# EasyEDA schematic mic_jammer_schematic_easyeda.json
TITLE: Sheet_2; REV: 1.0; Date: 2025-10-20; Sheet: 1/1; Drawn By: ardyprmbn7; Company: Your Company
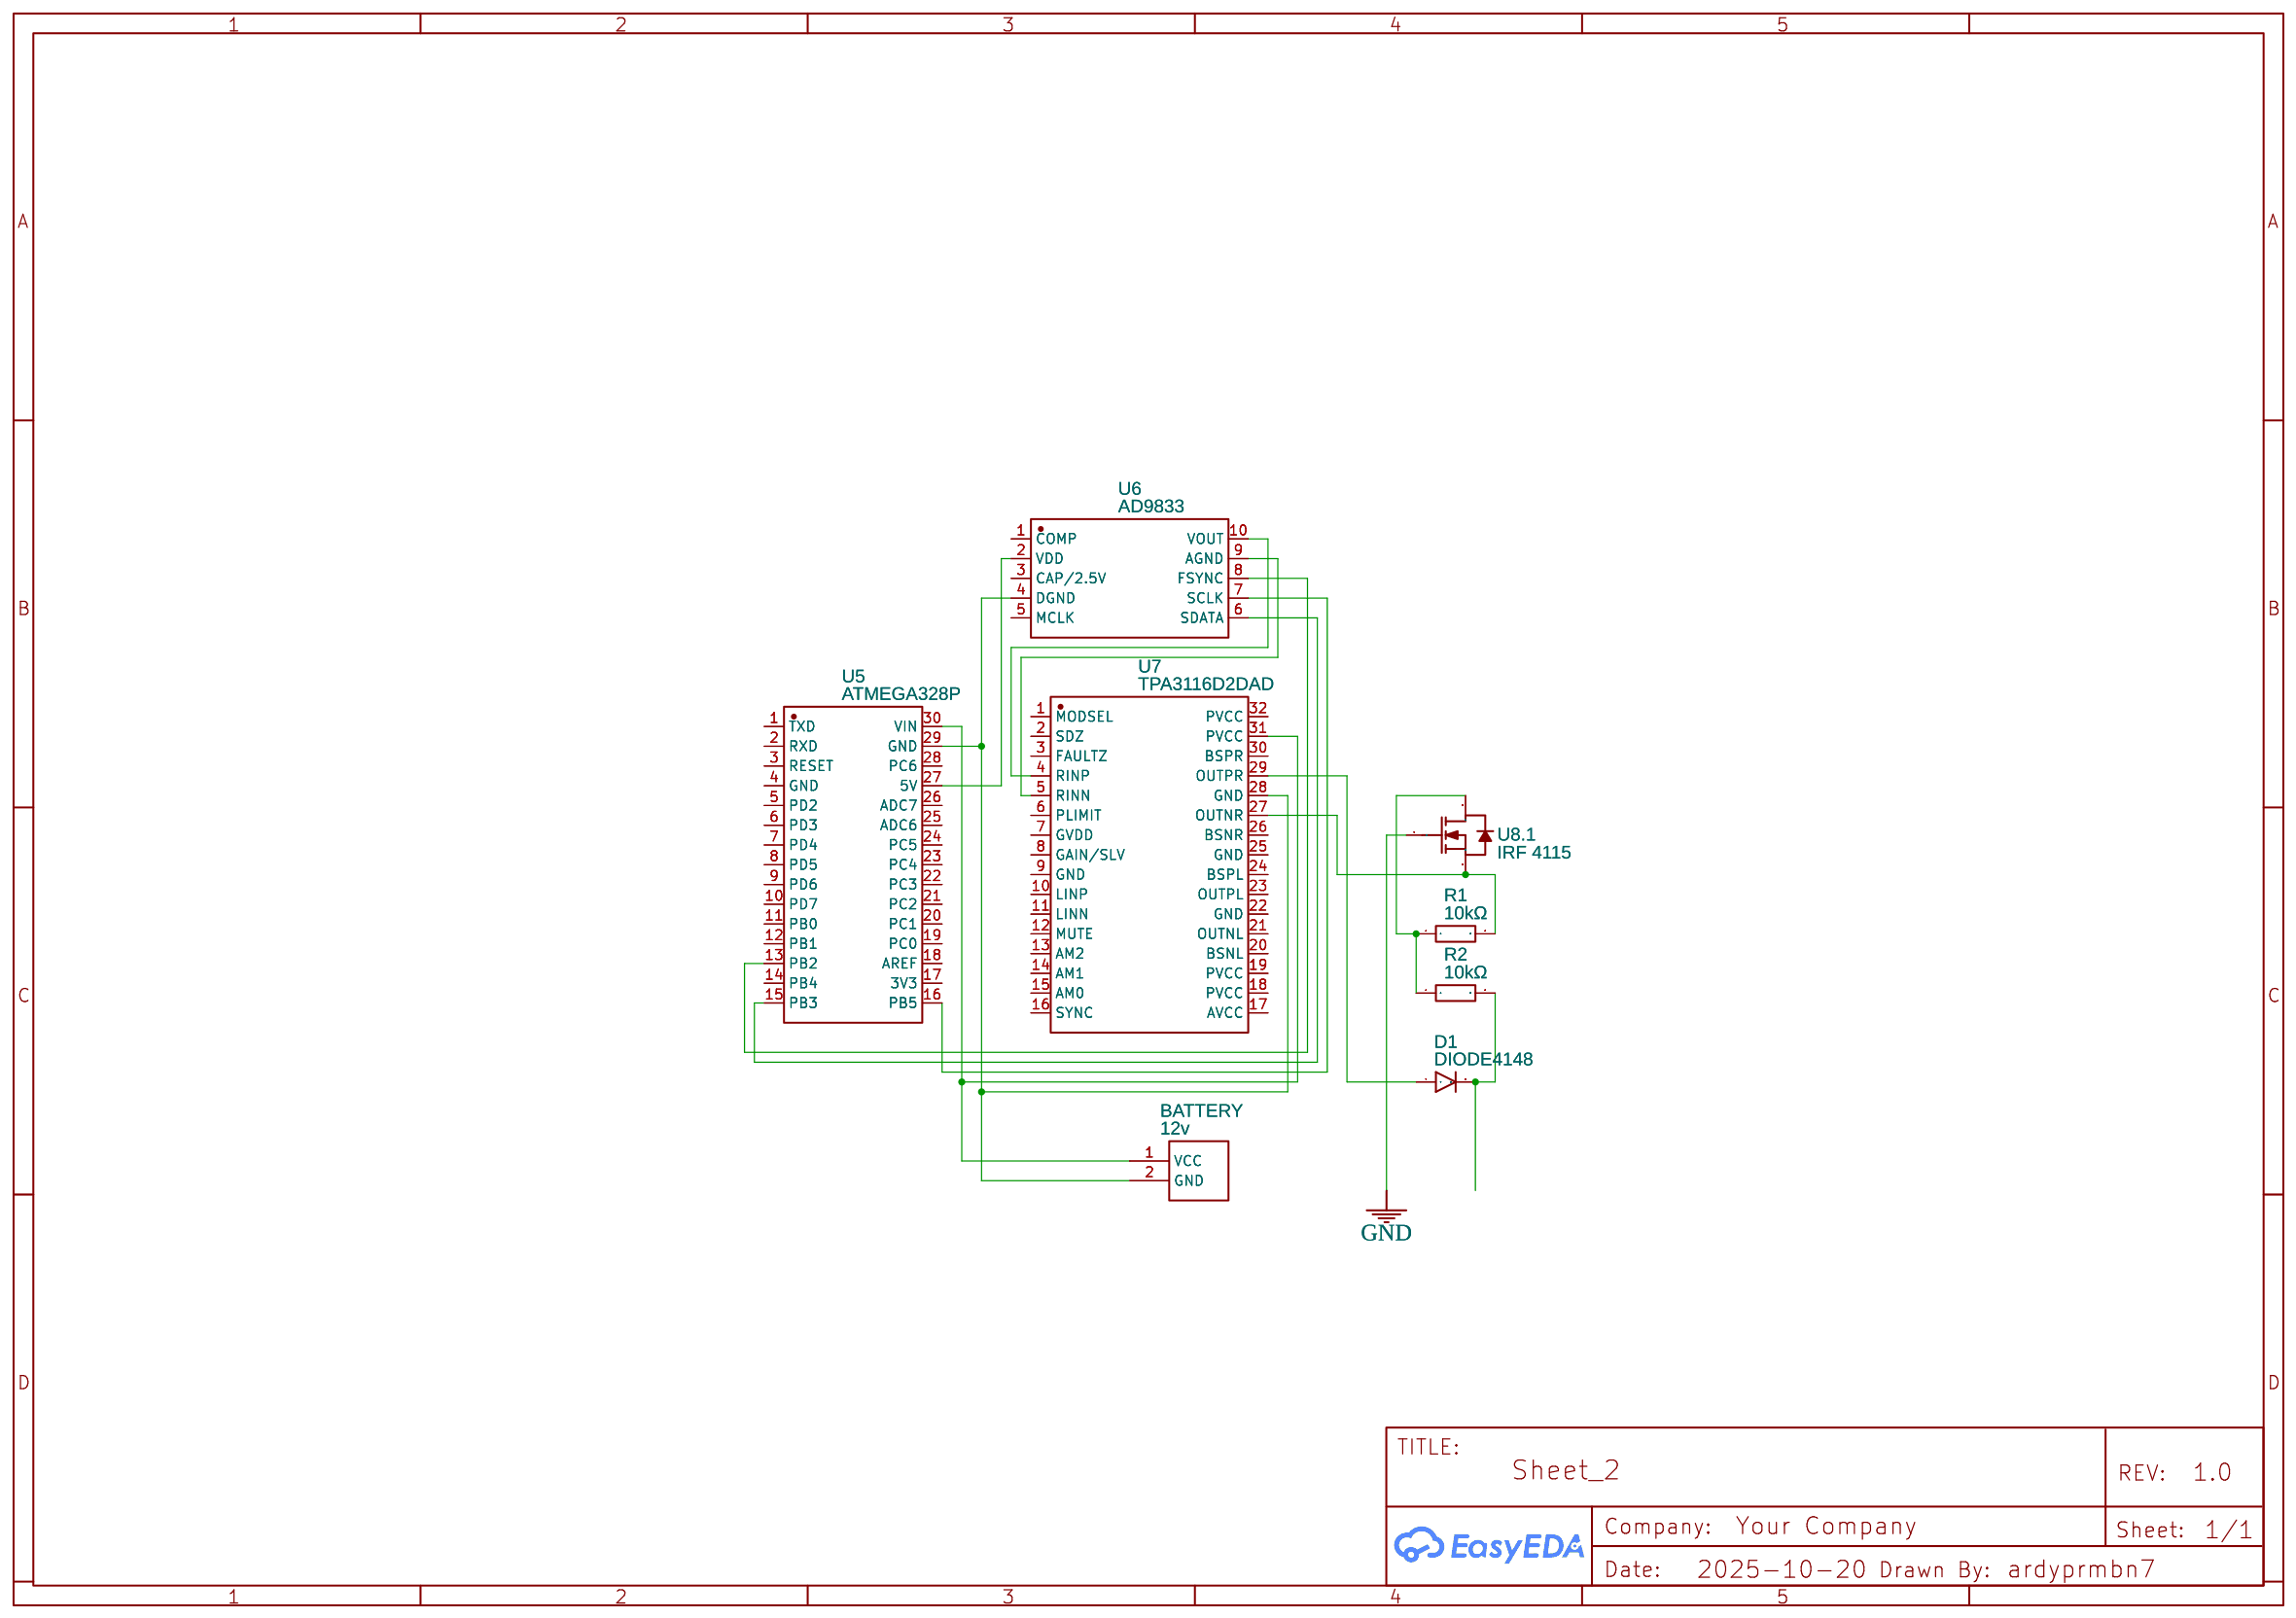
[diagram p0: schematic sheet]

## Parts
BATTERY  12v  [BAT-TH_BC2AA]
D1  DIODE4148  [DO-1N4148]
R1  10kΩ  [RES-TH_OHMITE_TA203PAXXXXX]
R2  10kΩ  [RES-TH_OHMITE_TA203PAXXXXX]
U5  ATMEGA328P  [COMM-TH_L43.2-W17.8-P2.54_ATMEGA328P]
U6  AD9833  [MSOP-10_L3.0-W3.0-P0.50-LS5.0-BL]
U7  TPA3116D2DAD  [HTSSOP-32_L11.0-W6.1-P0.65-LS8.1-BL]
U8  IRF 4115  [TDSON-8-4_IRF40H233]  (section 1)

## Library data of the parts
BATTERY = No.52Section side by side battery box: Supplier: LCSC; Manufacturer: 国产; Manufacturer Part: 五号2节并列电池盒; Supplier Part: C5404; JLCPCB Part Class: Extended Part
D1 = DIODE4148: Contributor: Tonigau
R1 R2 = TA203PA10K0JE: Contributor: lcsc; Supplier: LCSC; Supplier Part: C3502562; Manufacturer: Ohmite; JLCPCB Part Class: Extended Part
U5 = ATMEGA328P USB MINI MICRO TYPEC-C (AKA ARDUINO NANO V3): Supplier: LCSC; Supplier Part: C9900187880; Manufacturer: null; Manufacturer Part: ATMEGA328P USB Mini Micro Typec-C (aka Arduino Nano V3); JLCPCB Part Class: Extended Part; Contributor: lcsc
U6 = AD9833BRMZ-REEL: Contributor: LCSC; Supplier: LCSC; Supplier Part: C653879; Manufacturer: ADI(亚德诺); JLCPCB Part Class: Extended Part
U7 = TPA3116D2DAD: Supplier: LCSC; Manufacturer: TI(德州仪器); Manufacturer Part: TPA3116D2DADR; Supplier Part: C50144; JLCPCB Part Class: Extended Part
U8 = IPG20N04S4L18AATMA1: subpart_no: 1; Supplier: LCSC; Supplier Part: C3288865; Manufacturer: Infineon(英飞凌); JLCPCB Part Class: Extended Part

## Nets
GND: U8.4(G)
Net-(BATTERY-1): BATTERY.1(VCC) U5.30(VIN) U7.31(PVCC)
Net-(BATTERY-2): BATTERY.2(GND) U5.29(GND) U6.4(DGND) U7.28(GND)
Net-(D1-A): D1.A U7.29(OUTPR)
Net-(D1-C): D1.C R2.2
Net-(R1-1): R1.1 R2.1 U8.5(D)
Net-(R1-2): R1.2 U7.27(OUTNR) U8.3(S)
Net-(U5-13): U5.13(PB2) U6.8(FSYNC)
Net-(U5-15): U5.15(PB3) U6.6(SDATA)
Net-(U5-16): U5.16(PB5) U6.7(SCLK)
Net-(U5-27): U5.27(5V) U6.2(VDD)
Net-(U6-9): U6.9(AGND) U7.5(RINN)
Net-(U6-10): U6.10(VOUT) U7.4(RINP)

Not connected (* = marked no-connect by the designer): U5 1(TXD) 2(RXD) 3(RESET) 4(GND) 5(PD2) 6(PD3) 7(PD4) 8(PD5) 9(PD6) 10(PD7) 11(PB0) 12(PB1) 14(PB4) 17(3V3) 18(AREF) 19(PC0) 20(PC1) 21(PC2) 22(PC3) 23(PC4) 24(PC5) 25(ADC6) 26(ADC7) 28(PC6); U6 1(COMP) 3(CAP/2.5V) 5(MCLK); U7 1(MODSEL) 2(SDZ) 3(FAULTZ) 6(PLIMIT) 7(GVDD) 8(GAIN/SLV) 9(GND) 10(LINP) 11(LINN) 12(MUTE) 13(AM2) 14(AM1) 15(AM0) 16(SYNC) 17(AVCC) 18(PVCC) 19(PVCC) 20(BSNL) 21(OUTNL) 22(GND) 23(OUTPL) 24(BSPL) 25(GND) 26(BSNR) 30(BSPR) 32(PVCC)
